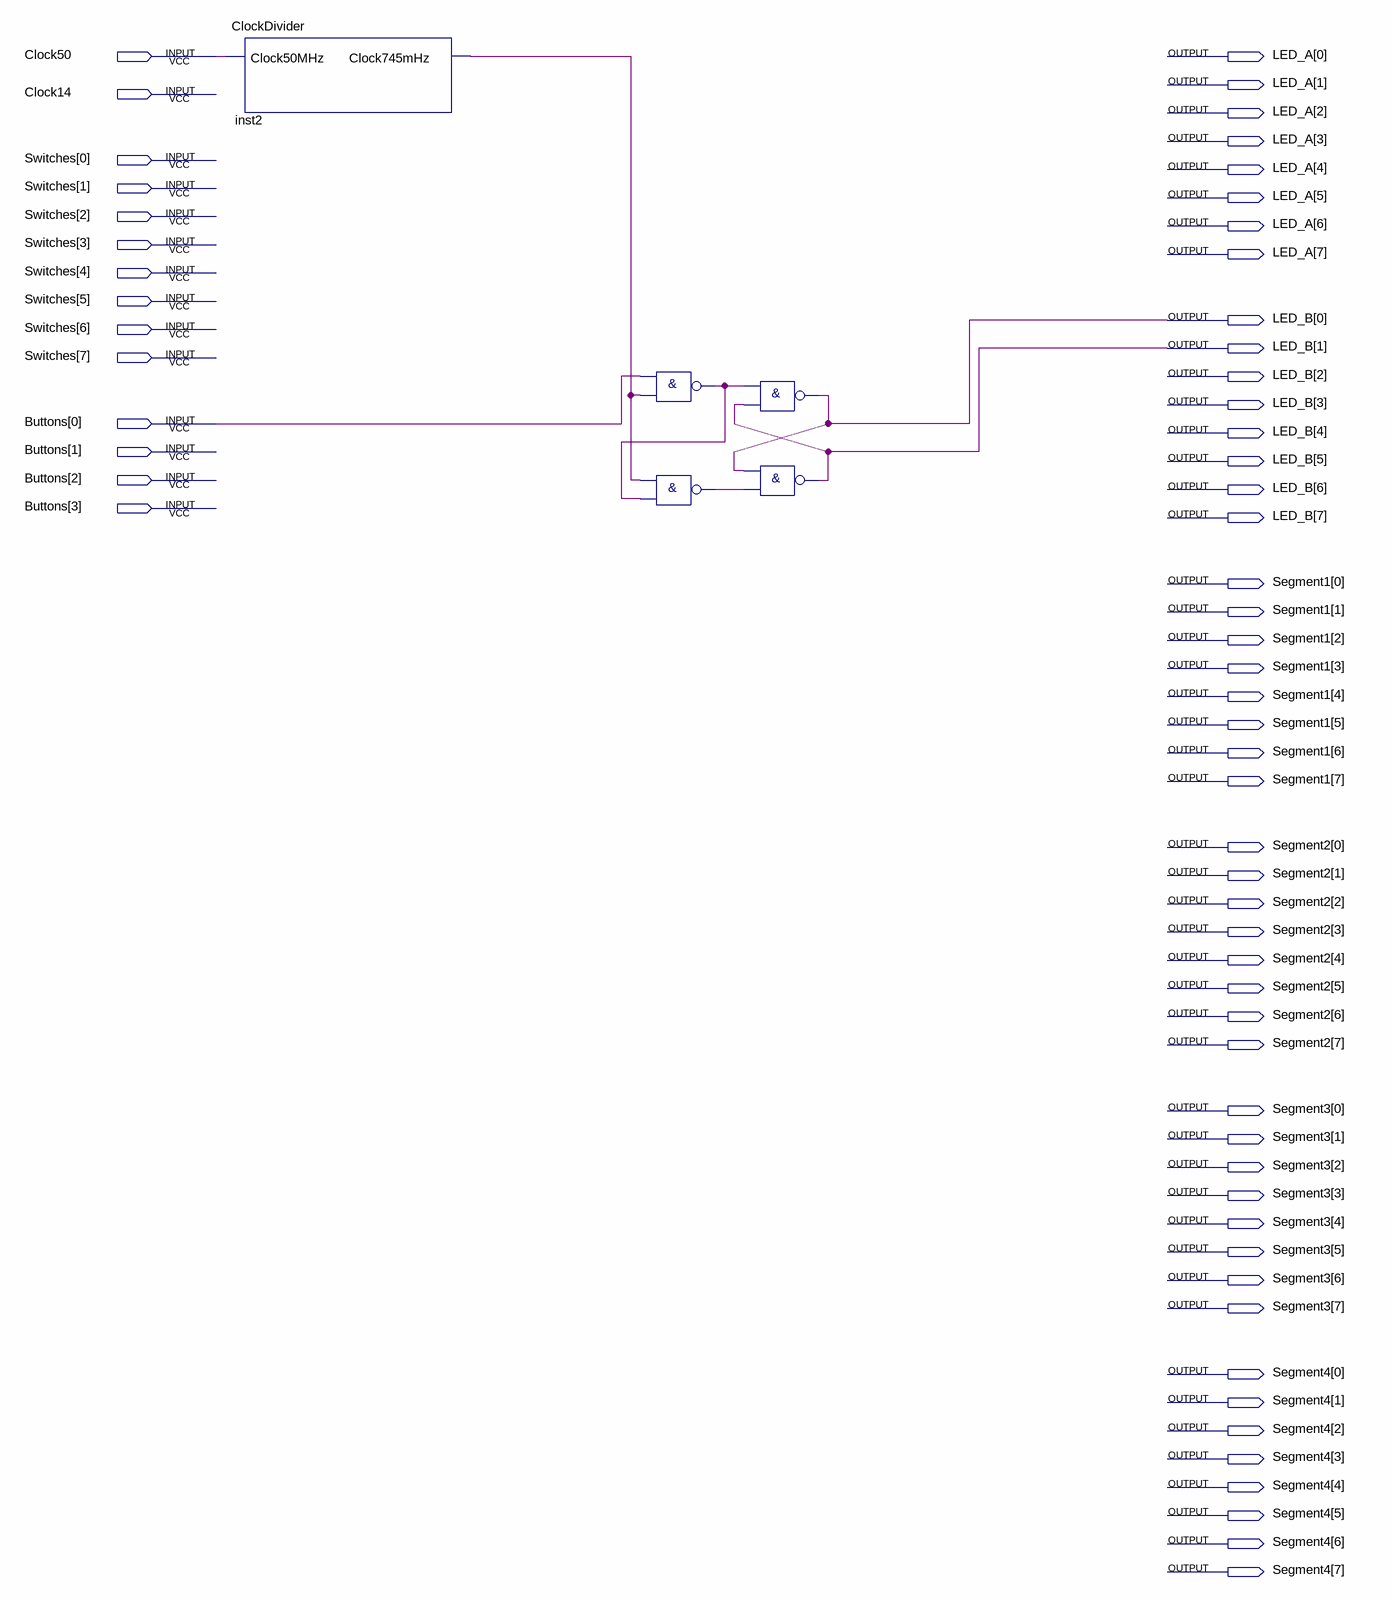
[diagram p0: schematic sheet]
// Quartus schematic DFlipFlop.bdf as structural Verilog: 5 symbols, 62 pins
module DFlipFlop (
  input  Clock50,
  input  Clock14,
  input  [7:0] Switches,
  input  [3:0] Buttons,
  output [7:0] LED_A,
  output [7:0] LED_B,
  output [7:0] Segment1,
  output [7:0] Segment2,
  output [7:0] Segment3,
  output [7:0] Segment4
);

  wire inst2_clock745mhz, inst5_out, inst8_out;

  ClockDivider inst2 (.Clock50MHz(Clock50), .Clock745mHz(inst2_clock745mhz));
  nand inst5 (inst5_out, Buttons[0], inst2_clock745mhz);
  nand inst8 (inst8_out, inst2_clock745mhz, inst5_out);
  nand inst6 (LED_B[0], inst5_out, LED_B[1]);
  nand inst7 (LED_B[1], LED_B[0], inst8_out);
endmodule
